# Altium schematic sheet Voltage_limiter.SchDoc
size A4
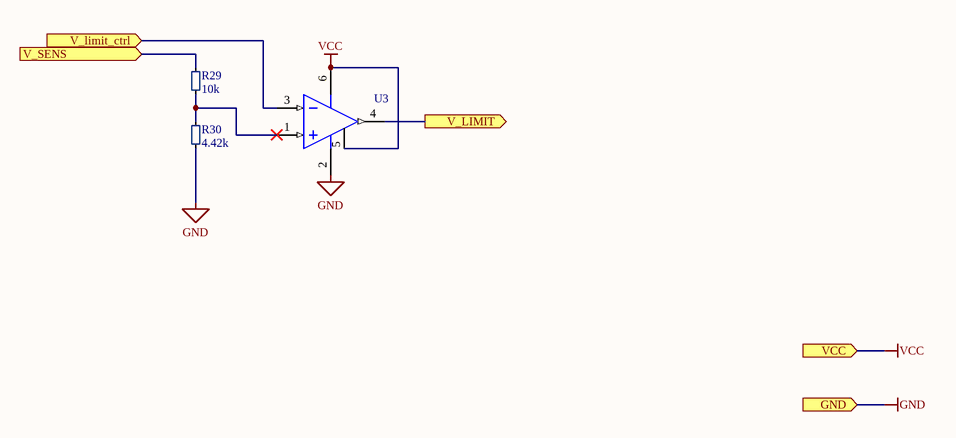
[diagram p0: Voltage_limiter.SchDoc]

## Parts
R29  Resistance: 10k  [SMD_0402(1005)_M]  (hidden comment: RC0402FR-0710KL)
R30  Resistance: 4.42k  [SMD_0402(1005)_M]  (hidden comment: RC0402FR-074K42L)
U3  LMV341IDBVR  [SOT95P280X145-6N]  (value not drawn)

## Ports
GND (in), V_LIMIT (out), V_limit_ctrl (in), V_SENS (in), VCC (in)

## Nets
GND: R30.1 U3.2(VEE/GND) ; port GND
VCC: U3.5(!SHDN) U3.6(VCC) ; port VCC
V_LIMIT: U3.4(OUT1) ; port V_LIMIT
V_limit_ctrl: U3.3(IN1-) ; port V_limit_ctrl
V_SENS: R29.2 ; port V_SENS
NetR29_1: R29.1 R30.2 U3.1(IN1+)

## Library data of the parts
R29 = CMP-008-0005-9: Surface Mount Thick Film Resistor, Rc Series, 10 Kohm, 62.5 Mw, - 1%, 50 V, 0402 [1005 Metric]; Voltage Rating: 50V; Temperature Coefficient: 100ppm/°C; Power Rating: 62.5mW; Value: 10k; Case/Package: 0402; Lead Free: Lead Free; Case Code (Imperial): 0402; Termination: SMD/SMT; Max Operating Temperature: 155°C; Height: 0.32mm; Length: 1mm; Min Operating Temperature: -55°C; Case Code (Metric): 1005; Depth: 0.5mm; Mount: SMD; REACH SVHC: No SVHC; Military Standard: Not; Tolerance: 1%; Number of Pins: 2; Voltage Rating (DC): 50V; Composition: Thick Film; RoHS: Yes; Packaging: Tape and Reel; Width: 0.5mm; Lead Pitch: 0.2mm; Working Voltage: 50V; Number of Terminations: 2
R30 = CMP-0001-00002-5: RES SMD 4.42K OHM 1% 1/16W 0402; Max Power Dissipation: 63mW; Temperature Coefficient: 100ppm/°C; Power Rating: 62.5mW; Voltage Rating: 50V; Termination: SMD/SMT; RoHS: Yes; Military Standard: Not; Case/Package: 0402; Min Operating Temperature: -55°C; Width: 0.02inch; Height: 0.016inch; Case Code (Metric): 1005; Length: 1mm; Mount: SMD; Depth: 0.5mm; Composition: Thick Film; Contact Plating: Tin,Matte; Number of Terminations: 2; Packaging: Tape and Reel; Lead Free: Lead Free; Max Operating Temperature: 155°C; Value: 4.42k; Features: Moisture Resistant; Case Code (Imperial): 0402; Tolerance: 1%
U3 = CMP-ROOT-00000-1: Single Rail-To-Rail Output CMOS Operational Amplifier with Shutdown 6-SOT-23 -40 to 125; Voltage Gain: 116dB; Output Current: 32mA; Number of Channels: 1; Common Mode Rejection Ratio: 56dB; Input Offset Voltage (Vos): 250uV; Bandwidth: 1MHz; Max Supply Voltage: 5.5V; Max Frequency: 1kHz; Output Current per Channel: 113mA; Operating Supply Current: 107uA; Slew Rate: 1V/µs; Input Bias Current: 200pA; Nominal Supply Current: 170uA; Min Supply Voltage: 2.5V; Radiation Hardening: No; Number of Amplifiers: 1; Height: 1.3mm; Number of Circuits: 1; Gain Bandwidth Product: 1MHz; Unity Gain Bandwidth Product: 1MHz; Package Quantity: 1; RoHS: Yes; Width: 1.75mm; Length: 3.05mm; Mount: Surface Mount; REACH SVHC: No SVHC; Contact Plating: Gold; Packaging: Tape and Reel; Number of Pins: 6; Lead Free: Lead Free; Case/Package: SOT-23; Number of Elements: 1; Max Operating Temperature: 125°C; Min Operating Temperature: -40°C